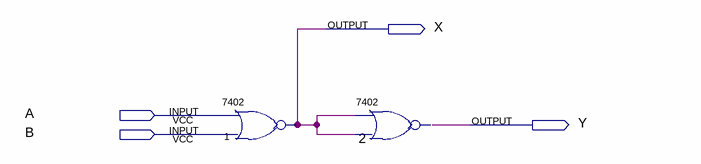
[diagram p0: schematic sheet]
// Quartus schematic Project.bdf as structural Verilog: 2 symbols, 4 pins
module Project (
  input  A,
  input  B,
  output X,
  output Y
);

  \7402  u_1 (.\2 (A), .\3 (B), .\1 (X));
  \7402  u_2 (.\2 (X), .\3 (X), .\1 (Y));
endmodule
